# Altium schematic sheet ATRACK_KP_V1.SchDoc
size A4
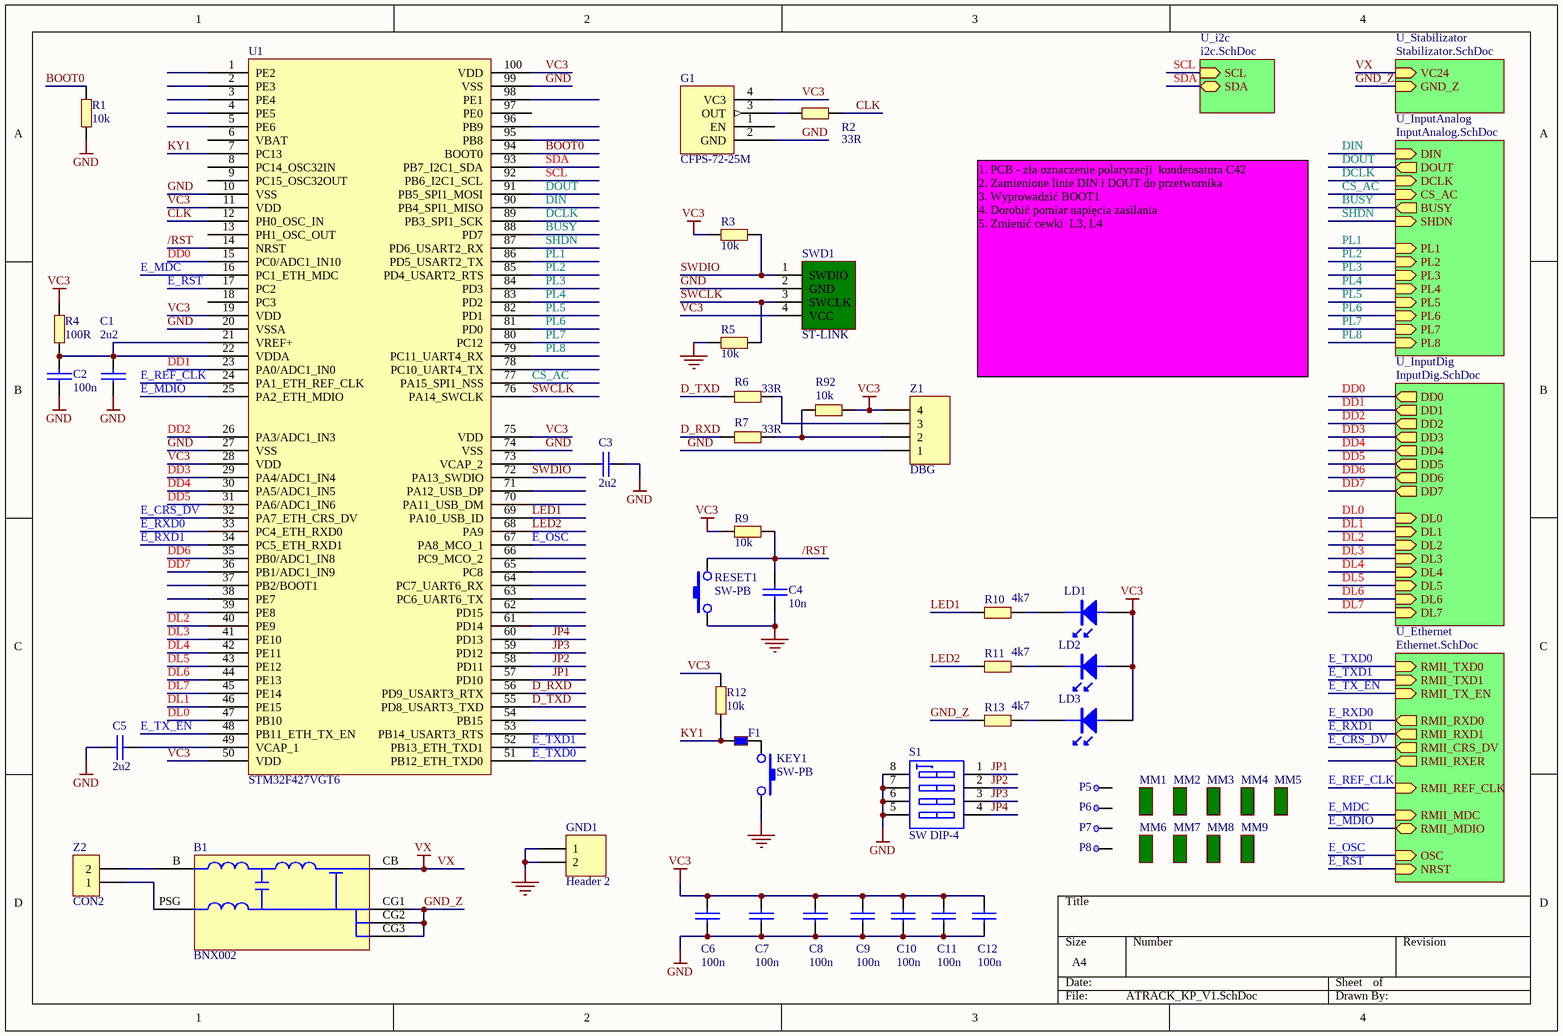
[diagram p0: ATRACK_KP_V1.SchDoc]

## Parts
B1  BNX002  [BNX002]
C1  2u2  [0603C]
C2  100n  [0603C]
C3  2u2  [0603C]
C4  10n  [0603C]
C5  2u2  [0603C]
C6  100n  [0603C]
C7  100n  [0603C]
C8  100n  [0603C]
C9  100n  [0603C]
C10  100n  [0603C]
C11  100n  [0603C]
C12  100n  [0603C]
F1  BLM18BB141SN1D  [0603L]  (value not drawn)
G1  CFPS-72-25M  [GEN_SMD1_1]
GND1  Header 2  [HDR1X2]
KEY1  SW-PB  [DTSM31N_2]
LD1  (no value)  [0603DG]
LD2  (no value)  [0603DR]
LD3  (no value)  [0603DG]
MM1  (no value)  [REF_CIR]
MM2  (no value)  [REF_CIR]
MM3  (no value)  [REF_SQR]
MM4  (no value)  [REF_SQR]
MM5  (no value)  [PB_FREE_GRAF]
MM6  (no value)  [REF_CIR]
MM7  (no value)  [REF_CIR]
MM8  (no value)  [REF_SQR]
MM9  (no value)  [REF_SQR]
P5  PP  [PP_SR]  (value not drawn)
P6  PP  [PP_SR]  (value not drawn)
P7  PP  [PP_SR]  (value not drawn)
P8  PP  [PP_SR]  (value not drawn)
R1  10k  [0603R]
R2  33R  [0603R]
R3  10k  [0603R]
R4  100R  [0603R]
R5  10k  [0603R]
R6  33R  [0603R]
R7  33R  [0603R]
R9  10k  [0603R]
R10  4k7  [0603R]
R11  4k7  [0603R]
R12  10k  [0603R]
R13  4k7  [0603R]
R92  10k  [0603R]
RESET1  SW-PB  [DTSM31N_2]
S1  SW DIP-4  [DIP8-SW]
SWD1  ST-LINK  [PIN4]
U1  STM32F427VGT6  [VQ100_2]
Z1  DBG  [PIN4]
Z2  CON2  [ARC-2-5.08-A1]

## Sub-sheets
U_Ethernet = Ethernet.SchDoc: RMII_TXD0 (in), RMII_TX_EN (in), RMII_RXD0 (out), RMII_REF_CLK (in), RMII_CRS_DV (out), RMII_MDC (in), RMII_MDIO (bidir), NRST (in), RMII_TXD1 (in), RMII_RXD1 (out), RMII_RXER (out), OSC (in)
U_i2c = i2c.SchDoc: SCL (in), SDA (bidir)
U_InputAnalog = InputAnalog.SchDoc: PL1 (in), PL2 (in), PL3 (in), PL4 (in), PL5 (in), PL6 (in), PL7 (in), DIN (in), DOUT (out), CS_AC (in), DCLK (in), BUSY (out), SHDN (in), PL8 (in)
U_InputDig = InputDig.SchDoc: DL0 (in), DL1 (in), DL2 (in), DL3 (in), DL4 (in), DL5 (in), DL6 (in), DL7 (in), DD0 (out), DD1 (out), DD2 (out), DD3 (out), DD4 (out), DD5 (out), DD6 (out), DD7 (out)
U_Stabilizator = Stabilizator.SchDoc: VC24 (in), GND_Z (in)

## Nets
GND: C1.2 C2.2 C3.1 C4.2 C5.1 C6.2 C7.2 C8.2 C9.2 C10.2 C11.2 C12.2 G1.2(GND) GND1.1 GND1.2 KEY1.2 R1.2 R5.1 RESET1.1 S1.5(B4) S1.6(B3) S1.7(B2) S1.8(B1) SWD1.2(GND) U1.10(VSS) U1.20(VSSA) U1.27(VSS) U1.74(VSS) U1.99(VSS) Z1.1
VC3: C6.1 C7.1 C8.1 C9.1 C10.1 C11.1 C12.1 G1.4(VC3) LD1.A LD2.A LD3.A R3.1 R4.2 R9.1 R12.2 R92.2 SWD1.4(VCC) U1.11(VDD) U1.19(VDD) U1.28(VDD) U1.50(VDD) U1.75(VDD) U1.100(VDD) Z1.4
VX: B1.CB ; sheet U_Stabilizator/VC24
/RST: C4.1 R9.2 RESET1.2 U1.14(NRST)
BOOT0: R1.1 U1.94(BOOT0)
BUSY: U1.88(PD7) ; sheet U_InputAnalog/BUSY
CLK: R2.2 U1.12(PH0_OSC_IN)
CS_AC: U1.77(PA15_SPI1_NSS) ; sheet U_InputAnalog/CS_AC
D_RXD: R7.2 U1.56(PD9_USART3_RTX)
D_TXD: R6.2 U1.55(PD8_USART3_TXD)
DCLK: U1.89(PB3_SPI1_SCK) ; sheet U_InputAnalog/DCLK
DD0: U1.15(PC0/ADC1_IN10) ; sheet U_InputDig/DD0
DD1: U1.23(PA0/ADC1_IN0) ; sheet U_InputDig/DD1
DD2: U1.26(PA3/ADC1_IN3) ; sheet U_InputDig/DD2
DD3: U1.29(PA4/ADC1_IN4) ; sheet U_InputDig/DD3
DD4: U1.30(PA5/ADC1_IN5) ; sheet U_InputDig/DD4
DD5: U1.31(PA6/ADC1_IN6) ; sheet U_InputDig/DD5
DD6: U1.35(PB0/ADC1_IN8) ; sheet U_InputDig/DD6
DD7: U1.36(PB1/ADC1_IN9) ; sheet U_InputDig/DD7
DIN: U1.90(PB4_SPI1_MISO) ; sheet U_InputAnalog/DIN
DL0: U1.47(PB10) ; sheet U_InputDig/DL0
DL1: U1.46(PE15) ; sheet U_InputDig/DL1
DL2: U1.40(PE9) ; sheet U_InputDig/DL2
DL3: U1.41(PE10) ; sheet U_InputDig/DL3
DL4: U1.42(PE11) ; sheet U_InputDig/DL4
DL5: U1.43(PE12) ; sheet U_InputDig/DL5
DL6: U1.44(PE13) ; sheet U_InputDig/DL6
DL7: U1.45(PE14) ; sheet U_InputDig/DL7
DOUT: U1.91(PB5_SPI1_MOSI) ; sheet U_InputAnalog/DOUT
E_CRS_DV: U1.32(PA7_ETH_CRS_DV) ; sheet U_Ethernet/RMII_CRS_DV
E_MDC: U1.16(PC1_ETH_MDC) ; sheet U_Ethernet/RMII_MDC
E_MDIO: U1.25(PA2_ETH_MDIO) ; sheet U_Ethernet/RMII_MDIO
E_OSC: U1.67(PA8_MCO_1) ; sheet U_Ethernet/OSC
E_REF_CLK: U1.24(PA1_ETH_REF_CLK) ; sheet U_Ethernet/RMII_REF_CLK
E_RST: U1.17(PC2) ; sheet U_Ethernet/NRST
E_RXD0: U1.33(PC4_ETH_RXD0) ; sheet U_Ethernet/RMII_RXD0
E_RXD1: U1.34(PC5_ETH_RXD1) ; sheet U_Ethernet/RMII_RXD1
E_TX_EN: U1.48(PB11_ETH_TX_EN) ; sheet U_Ethernet/RMII_TX_EN
E_TXD0: U1.51(PB12_ETH_TXD0) ; sheet U_Ethernet/RMII_TXD0
E_TXD1: U1.52(PB13_ETH_TXD1) ; sheet U_Ethernet/RMII_TXD1
GND_Z: B1.CG1 B1.CG2 B1.CG3 R13.2 ; sheet U_Stabilizator/GND_Z
JP1: S1.1(A1) U1.57(PD10)
JP2: S1.2(A2) U1.58(PD11)
JP3: S1.3(A3) U1.59(PD12)
JP4: S1.4(A4) U1.60(PD13)
KY1: F1.2 R12.1 U1.7(PC13)
LED1: R10.2 U1.69(PA10_USB_ID)
LED2: R11.2 U1.68(PA9)
PL1: U1.86(PD5_USART2_TX) ; sheet U_InputAnalog/PL1
PL2: U1.85(PD4_USART2_RTS) ; sheet U_InputAnalog/PL2
PL3: U1.84(PD3) ; sheet U_InputAnalog/PL3
PL4: U1.83(PD2) ; sheet U_InputAnalog/PL4
PL5: U1.82(PD1) ; sheet U_InputAnalog/PL5
PL6: U1.81(PD0) ; sheet U_InputAnalog/PL6
PL7: U1.80(PC12) ; sheet U_InputAnalog/PL7
PL8: U1.79(PC11_UART4_RX) ; sheet U_InputAnalog/PL8
SCL: U1.92(PB6_I2C1_SCL) ; sheet U_i2c/SCL
SDA: U1.93(PB7_I2C1_SDA) ; sheet U_i2c/SDA
SHDN: U1.87(PD6_USART2_RX) ; sheet U_InputAnalog/SHDN
SWCLK: R5.2 SWD1.3(SWCLK) U1.76(PA14_SWCLK)
SWDIO: R3.2 SWD1.1(SWDIO) U1.72(PA13_SWDIO)
NetB1_B: B1.B Z2.2
NetB1_PSG: B1.PSG Z2.1
NetC1_1: C1.1 C2.1 R4.1 U1.21(VREF+) U1.22(VDDA)
NetC3_2: C3.2 U1.73(VCAP_2)
NetC5_2: C5.2 U1.49(VCAP_1)
NetF1_1: F1.1 KEY1.1
NetG1_3: G1.3(OUT) R2.1
NetLD1_K: LD1.K R10.1
NetLD2_K: LD2.K R11.1
NetLD3_K: LD3.K R13.1
NetR6_1: R6.1 Z1.3
NetR7_1: R7.1 R92.1 Z1.2

Not connected (* = marked no-connect by the designer): G1 1(EN); P5 1; P6 1; P7 1; P8 1; U1 1(PE2) 2(PE3) 3(PE4) 4(PE5) 5(PE6) 6(VBAT) 8(PC14_OSC32IN) 9(PC15_OSC32OUT) 13(PH1_OSC_OUT) 18(PC3) 37(PB2/BOOT1) 38(PE7) 39(PE8) 53(PB14_USART3_RTS) 54(PB15) 61(PD14) 62(PD15) 63(PC6_UART6_TX) 64(PC7_UART6_RX) 65(PC8) 66(PC9_MCO_2) 70(PA11_USB_DM) 71(PA12_USB_DP) 78(PC10_UART4_TX) 95(PB8) 96(PB9) 97(PE0) 98(PE1)

## Notes on the sheet
- 1. PCB - zła oznaczenie polaryzacji  kondensatora C42
  2. Zamienione linie DIN i DOUT do przetwornika
  3. Wyprowadzić BOOT1
  4. Dorobić pomiar napięcia zasilania
  5. Zmienić cewki  L3, L4

## Library data of the parts
C1-C12 = CAP: Capacitor
F1 = KORALIK: Koralik ferrytowy
G1 = GENER_SMD
GND1 = Header 2: Header, 2-Pin; LatestRevisionDate: 17-Jul-2002; LatestRevisionNote: Re-released for DXP Platform.; Publisher: Altium Limited
LD1-LD3 = LED
MM1-MM9 = MECH
R1-R7 R9-R13 R92 = RES3
S1 = SW DIP-4: DIP Switch
SWD1 = SW_CON: Header, 4-Pin; LatestRevisionDate: 17-Jul-2002; LatestRevisionNote: Re-released for DXP Platform.; Publisher: Altium Limited
U1 = STM32F427_LQFP100
Z1 = Header 4: Header, 4-Pin; LatestRevisionDate: 17-Jul-2002; LatestRevisionNote: Re-released for DXP Platform.; Publisher: Altium Limited
Z2 = CON2: Connector